# Altium schematic sheet smart-switch.SchDoc
size A3; DocumentNumber: 20; SheetNumber: 20; SheetTotal: 45; SheetDescription: Smart high-side switch
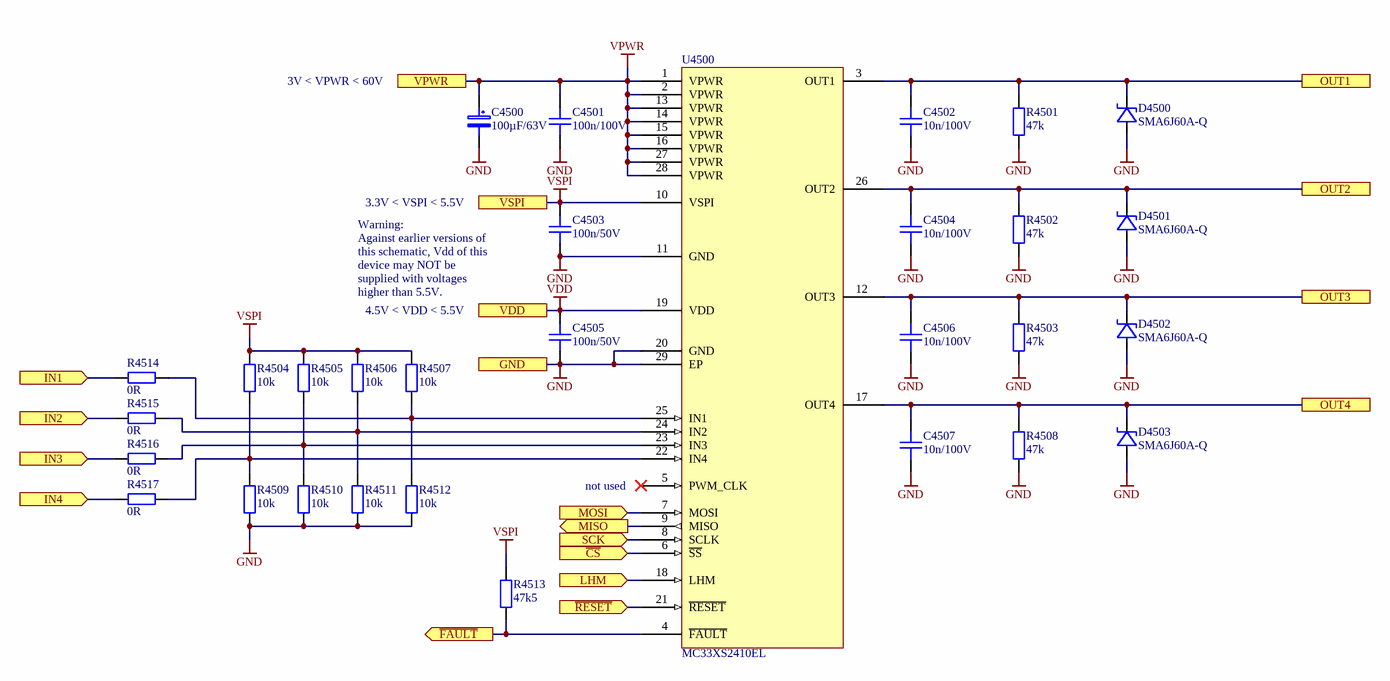
[diagram p0: smart-switch.SchDoc]

## Parts
C4500  100µF/63V  [ELECTROLYTIC_CAP_PANASONIC_G]
C4501  100n/100V  [CAPC1608X08N]
C4502  10n/100V  [CAPC1608X08N]
C4503  100n/50V  [CAPC1005X06N]
C4504  10n/100V  [CAPC1608X08N]
C4505  100n/50V  [CAPC1005X06N]
C4506  10n/100V  [CAPC1608X08N]
C4507  10n/100V  [CAPC1608X08N]
D4500  SMA6J60A-Q  [BOURNS_DO-214AC_SMA]
D4501  SMA6J60A-Q  [BOURNS_DO-214AC_SMA]
D4502  SMA6J60A-Q  [BOURNS_DO-214AC_SMA]
D4503  SMA6J60A-Q  [BOURNS_DO-214AC_SMA]
R4501  47k  [RESC1005X04N]
R4502  47k  [RESC1005X04N]
R4503  47k  [RESC1005X04N]
R4504  10k  [RESC1005X04N]
R4505  10k  [RESC1005X04N]
R4506  10k  [RESC1005X04N]
R4507  10k  [RESC1005X04N]
R4508  47k  [RESC1005X04N]
R4509  10k  [RESC1005X04N]
R4510  10k  [RESC1005X04N]
R4511  10k  [RESC1005X04N]
R4512  10k  [RESC1005X04N]
R4513  47k5  [RESC1005X04N]
R4514  0R  [RESC1005X04N]
R4515  0R  [RESC1005X04N]
R4516  0R  [RESC1005X04N]
R4517  0R  [RESC1005X04N]
U4500  MC33XS2410EL  [MC33XS2410EL]

## Ports
GND, IN1 (in), IN2 (in), IN3 (in), IN4 (in), LHM (in), MISO (out), MOSI (in), OUT1, OUT2, OUT3, OUT4, SCK (in), VDD, VPWR, VSPI, ~{CS} (in), ~{FAULT} (out), ~{RESET} (in)

## Nets
GND: C4500.2 C4501.1 C4502.1 C4503.1 C4504.1 C4505.1 C4506.1 C4507.1 D4500.2(A) D4501.2(A) D4502.2(A) D4503.2(A) R4501.1 R4502.1 R4503.1 R4508.1 R4509.1 R4510.1 R4511.1 R4512.1 U4500.11(GND) U4500.20(GND) U4500.29(EP) ; port GND
VDD: C4505.2 U4500.19(VDD) ; port VDD
VPWR: C4500.1 C4501.2 U4500.1(VPWR) U4500.2(VPWR) U4500.13(VPWR) U4500.14(VPWR) U4500.15(VPWR) U4500.16(VPWR) U4500.27(VPWR) U4500.28(VPWR) ; port VPWR
VSPI: C4503.2 R4504.2 R4505.2 R4506.2 R4507.2 R4513.2 U4500.10(VSPI) ; port VSPI
~{CS}: U4500.6(~{SS}) ; port ~{CS}
~{FAULT}: R4513.1 U4500.4(~{FAULT}) ; port ~{FAULT}
~{RESET}: U4500.21(~{RESET}) ; port ~{RESET}
IN1: R4514.1 ; port IN1
IN2: R4515.1 ; port IN2
IN3: R4516.1 ; port IN3
IN4: R4517.1 ; port IN4
LHM: U4500.18(LHM) ; port LHM
MISO: U4500.9(MISO) ; port MISO
MOSI: U4500.7(MOSI) ; port MOSI
OUT1: C4502.2 D4500.1(C) R4501.2 U4500.3(OUT1) ; port OUT1
OUT2: C4504.2 D4501.1(C) R4502.2 U4500.26(OUT2) ; port OUT2
OUT3: C4506.2 D4502.1(C) R4503.2 U4500.12(OUT3) ; port OUT3
OUT4: C4507.2 D4503.1(C) R4508.2 U4500.17(OUT4) ; port OUT4
SCK: U4500.8(SCLK) ; port SCK
NetR4504_1: R4504.1 R4509.2 R4517.2 U4500.22(IN4)
NetR4505_1: R4505.1 R4510.2 R4516.2 U4500.23(IN3)
NetR4506_1: R4506.1 R4511.2 R4515.2 U4500.24(IN2)
NetR4507_1: R4507.1 R4512.2 R4514.2 U4500.25(IN1)

Not connected (* = marked no-connect by the designer): U4500 5(PWM_CLK)*

## Notes on the sheet
- 3V < VPWR < 60V
- 3.3V < VSPI < 5.5V
- Warning:
  Against earlier versions of this schematic, Vdd of this device may NOT be supplied with voltages higher than 5.5V.
- 4.5V < VDD < 5.5V
- not used
- Fraunhofer IISB
- Schottkystr. 10
- developed by:
- 91058 Erlangen
- Germany
- Author
- Project
- License
- Description
- File
- Version
- Release Date
- Sheet
- foxbms.org <https://foxbms.org>
- www.iisb.fraunhofer.de <https://www.iisb.fraunhofer.de/>
- foxBMS Team
- /

## Library data of the parts
C4500 = EEE-TG1J101UP: SMD Electrolytic Capacitor; Capacitance: 100µF; Rated Voltage: 63V; Tolerance: +-20%; Heigth: 10.5mm; Automotive Qualified: True; Part Number: EEE-TG1J101UP; Operating Temperature: -40°C to 125°C; Diameter: 10mm; ComponentLink1Description: Datasheet; ComponentLink1URL: https://industrial.panasonic.com/cdbs/www-data/pdf/RDE0000/ABA0000C1187.pdf; Supplier 1: Digikey; Supplier Part Number 1: PCE4086CT-ND
C4501 = gen_C_ceramic_100n_100V_X7R_0603: MLCC; Capacitance: 100n; Rated Voltage: 100V; Dielectric: X7R; Case EIA: 0603; Case Metric: 1608; Automotive Qualified: True; PnP Package: 0603C; Part Number: gen_C_ceramic_100n_100V_X7R_0603; Supplier 1: Digikey; Supplier Part Number 1: 490-13420-1-ND; Supplier 2: Mouser; Supplier Part Number 2: 81-GCJ188R72A104KA1D
C4502 C4504 C4506 C4507 = gen_C_ceramic_10n_100V_X7R_0603: MLCC; Capacitance: 10n; Rated Voltage: 100V; Dielectric: X7R; Case EIA: 0603; Case Metric: 1608; PnP Package: 0603C; PnP Value: 10nF/100V/X7R; Automotive Qualified: True; AEC-Q Norm: AEC-Q200; Part Number: gen_C_ceramic_10n_100V_X7R_0603; Supplier 1: Farnell; Supplier Part Number 1: 1301715; Supplier 2: Farnell; Supplier Part Number 2: 2821192; Supplier 3: Farnell; Supplier Part Number 3: 2210878; ECCN: EAR99
C4503 C4505 = gen_C_ceramic_100n_50V_X7R_0402: MLCC; Capacitance: 100n; Rated Voltage: 50V; Dielectric: X7R; Case EIA: 0402; Case Metric: 1005; PnP Package: 0402C; PnP Value: 100nF/50V/X7R; PnP equipped: x; Automotive Qualified: True; AEC-Q Norm: AEC-Q200; Part Number: gen_C_ceramic_100n_50V_X7R_0402; Supplier 1: Farnell; Supplier Part Number 1: 2210822; ECCN: EAR99
D4500-D4503 = SMA6J60A-Q: TVS-Diode DO-214AC (SMA); Manufacturer: Bourns; Breakdown Voltage: 60V; Automotive Qualified: True; AEC-Q Norm: AEC-Q101; AEC-Q Grade: Grade 0; Part Number: SMA6J60A-Q; Part Name: SMA6J60A-Q; Operating Temperature: -55°C - +150°C; ComponentLink1Description: Datasheet; ComponentLink1URL: https://www.mouser.de/datasheet/2/54/sma6j_q-1919913.pdf; Supplier 1: Mouser; Supplier Part Number 1: 652-SMA6J60A-Q; ECCN: EAR99
R4501-R4503 R4508 = gen_R_47k_0402: SMD Resistor 47k 0402; Tolerance: 1%; Power: 0.063W; Case EIA: 0402; Case Metric: 1005; Maximum Working Voltage: 50V; PnP Package: 0402R; PnP equipped: x; Automotive Qualified: True; AEC-Q Norm: AEC-Q200; AEC-Q Grade: Grade 0; Part Number: gen_R_47k_0402; Operating Temperature: -55°C - +155°C; Resistance: 47k; Series: E24; PnP Value: 47k; Supplier 1: Digikey; Supplier Part Number 1: A129647CT-ND; ECCN: EAR99
R4504-R4507 R4509-R4512 = gen_R_10k_0402: SMD Resistor 10k 0402; Tolerance: 1%; Power: 0.063W; Case EIA: 0402; Case Metric: 1005; Maximum Working Voltage: 50V; PnP Package: 0402R; PnP equipped: x; Automotive Qualified: True; AEC-Q Norm: AEC-Q200; Part Number: gen_R_10k_0402; Operating Temperature: -55°C - +155°C; Resistance: 10k; Series: E24, E96; PnP Value: 10k; Supplier 1: Farnell; Supplier Part Number 1: 2059239; ECCN: EAR99
R4513 = gen_R_47k5_0402: SMD Resistor 47k5 0402; Tolerance: 1%; Power: 0.063W; Case EIA: 0402; Case Metric: 1005; Maximum Working Voltage: 50V; PnP Package: 0402R; Automotive Qualified: True; AEC-Q Grade: Grade 0; AEC-Q Norm: AEC-Q200; Part Number: gen_R_47k5_0402; Operating Temperature: -55°C - +155°C; Resistance: 47k5; Series: E96; PnP Value: 47k5; ECCN: EAR99; Supplier 1: Farnell; Supplier Part Number 1: 2563598
R4514-R4517 = gen_R_0R_0402: SMD Resistor 0R 0402; Power: 0.063W; Case EIA: 0402; Case Metric: 1005; Maximum Working Voltage: 50V; PnP Package: 0402R; Automotive Qualified: True; AEC-Q Norm: AEC-Q200; PnP equipped: x; Part Number: gen_R_0R_0402; Operating Temperature: -55°C - +155°C; Resistance: 0R; Series: Jumper; PnP Value: 0R; Supplier 1: Farnell; Supplier Part Number 1: 1469661; Supplier 2: Farnell; Supplier Part Number 2: 2059190; ECCN: EAR99
U4500 = MC33XS2410EL: Quad 100 mΩ / dual 50 mΩ, 3.0 V to 60 V high-side switch; Manufacturer: NXP; PnP Package: HTSSOP-28; Automotive Qualified: True; Part Number: MC33XS2410EL; Part Name: MC33XS2410EL; Operating Temperature: −40°C - +125°C